# Altium schematic sheet G11-KeyDispPrint.SCHDOC
size A3; SheetNumber: 0; SheetTotal: 0
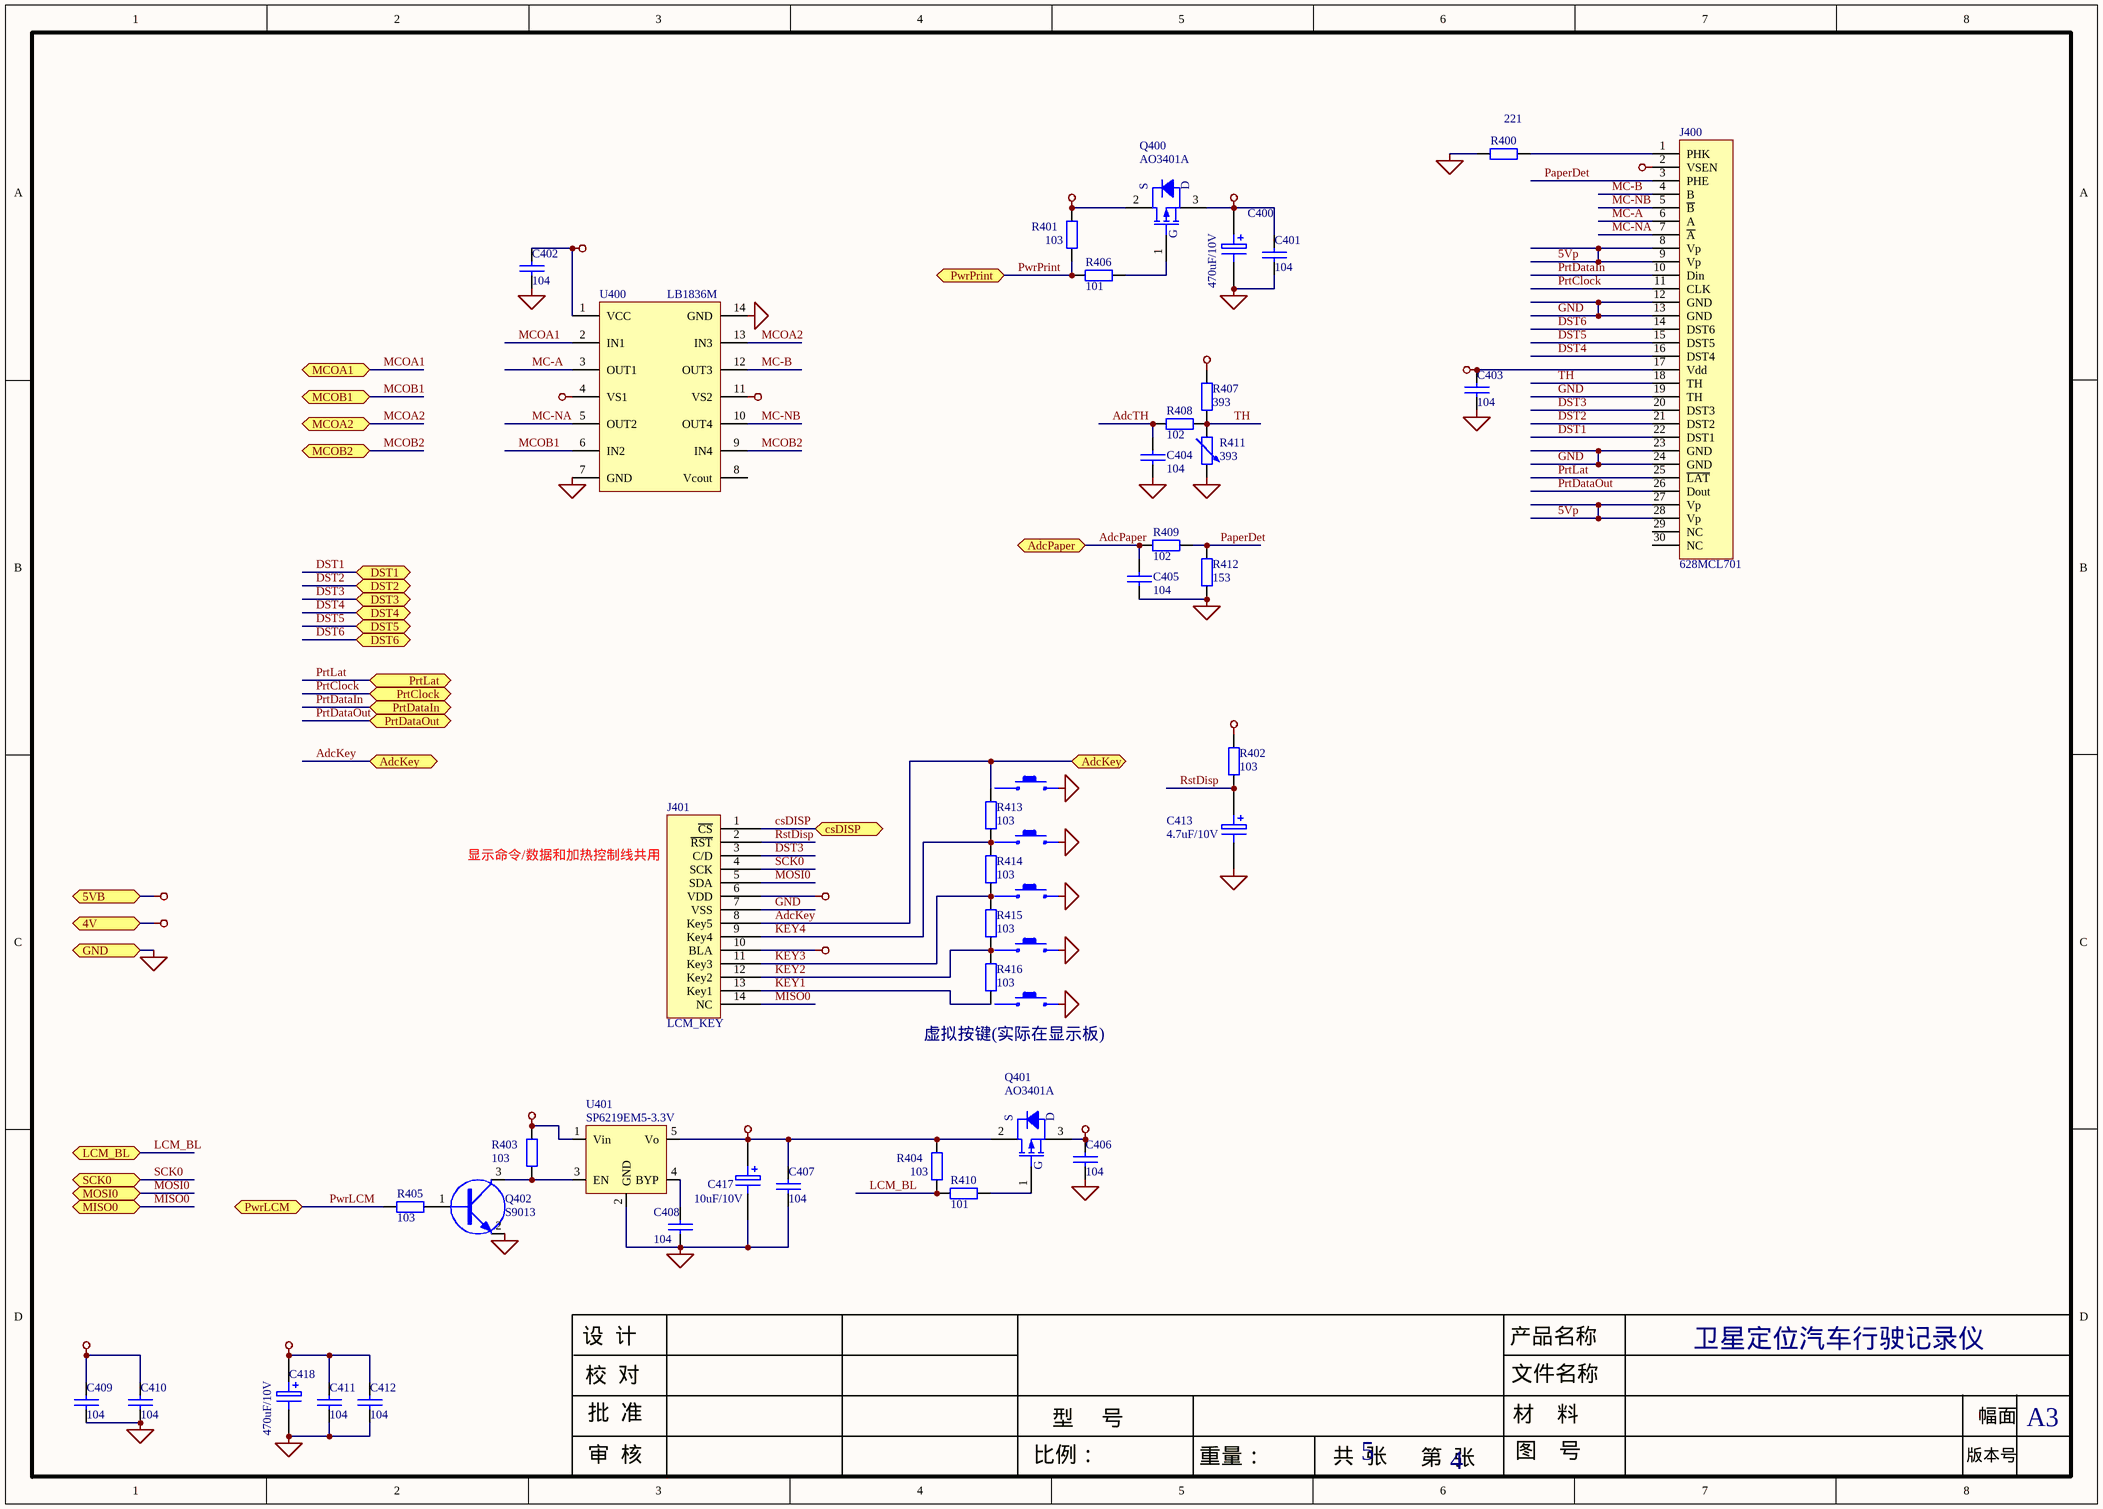
[diagram p0: G11-KeyDispPrint.SCHDOC]

## Parts
C400  470uF/10V  [RB-3.5mm]
C401  104  [C0603]
C402  104  [C0603]
C403  104  [C0603]
C404  104  [C0603]
C405  104  [C0603]
C406  104  [C0603]
C407  104  [C0603]
C408  104  [C0603]
C409  104  [C0603]
C410  104  [C0603]
C411  104  [C0603]
C412  104  [C0603]
C413  4.7uF/10V  [A(3216)]
C417  10uF/10V  [A(3216)]
C418  470uF/10V  [RB-3.5mm]
J400  628MCL701  [FPC-30H]
J401  LCM_KEY  [FPC-14-1.0]
Q400  AO3401A  [SOT-233PM]
Q401  AO3401A  [SOT-233PM]
Q402  S9013  [SOT-233]
R400  221  [R0603]
R401  103  [R0603]
R402  103  [R0603]
R403  103  [R0603]
R404  103  [R0603]
R405  103  [R0603]
R406  101  [R0603]
R407  393  [R0603]
R408  102  [R0603]
R409  102  [R0603]
R410  101  [R0603]
R411  value 393  [0603]  (hidden comment: Res Adj2)
R412  153  [R0603]
R413  103  [R0603]
R414  103  [R0603]
R415  103  [R0603]
R416  103  [R0603]
U400  LB1836M  [SO-G14-1.0mm]
U401  SP6219EM5-3.3V  [SOT-235]

## Ports
4V (bidir), 5VB (bidir), AdcKey, AdcKey (bidir), AdcPaper (bidir), csDISP (bidir), DST1 (bidir), DST2 (bidir), DST3 (bidir), DST4 (bidir), DST5 (bidir), DST6 (bidir), GND (bidir), LCM_BL (bidir), MCOA1 (bidir), MCOA2 (bidir), MCOB1 (bidir), MCOB2 (bidir), MISO0 (bidir), MOSI0 (bidir), PrtClock, PrtDataIn, PrtDataOut, PrtLat, PwrLCM (bidir), PwrPrint (bidir), SCK0 (bidir)

## Nets
3V3Lcm: C407.2 C417.1 J401.6(VDD) Q401.2(D) R402.1 R404.1 U401.5(Vo)
3V_BL: C406.2 J401.10(BLA) Q401.3(S)
4V: R403.2 U401.1(Vin) ; port 4V
5VB: C402.2 C409.2 C410.2 C411.2 C412.2 C418.1 Q400.2(D) R401.1 R407.1 U400.1(VCC) U400.4(VS1) U400.11(VS2) ; port 5VB
5Vp: C400.1 C401.2 C403.2 J400.2(VSEN) J400.8(Vp) J400.9(Vp) J400.17(Vdd) J400.27(Vp) J400.28(Vp) Q400.3(S)
GND: C400.2 C401.1 C402.1 C403.1 C404.2 C405.2 C406.1 C407.1 C408.1 C409.1 C410.1 C411.1 C412.1 C413.2 C417.2 C418.2 J400.12(GND) J400.13(GND) J400.19(TH) J400.23(GND) J400.24(GND) J401.7(VSS) Q402.2(E) R400.1 R411.2 R412.2 U400.7(GND) U400.14(GND) U401.2(GND) ; port GND
AdcKey: J401.8(Key5) R413.1 ; port AdcKey
AdcPaper: C405.1 R409.1 ; port AdcPaper
AdcTH: C404.1 R408.1
csDISP: J401.1(~{CS}) ; port csDISP
DST1: J400.22(DST1) ; port DST1
DST2: J400.21(DST2) ; port DST2
DST3: J400.20(DST3) J401.3(C/D) ; port DST3
DST4: J400.16(DST4) ; port DST4
DST5: J400.15(DST5) ; port DST5
DST6: J400.14(DST6) ; port DST6
KEY1: J401.13(Key1) R416.2
KEY2: J401.12(Key2) R415.2 R416.1
KEY3: J401.11(Key3) R414.2 R415.1
KEY4: J401.9(Key4) R413.2 R414.1
LCM_BL: R404.2 R410.2 ; port LCM_BL
MC-A: J400.6(A) U400.3(OUT1)
MC-B: J400.4(B) U400.12(OUT3)
MC-NA: J400.7(~{A}) U400.5(OUT2)
MC-NB: J400.5(~{B}) U400.10(OUT4)
MCOA1: U400.2(IN1) ; port MCOA1
MCOA2: U400.13(IN3) ; port MCOA2
MCOB1: U400.6(IN2) ; port MCOB1
MCOB2: U400.9(IN4) ; port MCOB2
MISO0: J401.14(NC) ; port MISO0
MOSI0: J401.5(SDA) ; port MOSI0
PaperDet: J400.3(PHE) R409.2 R412.1
PrtClock: J400.11(CLK) ; port PrtClock
PrtDataIn: J400.10(Din) ; port PrtDataIn
PrtDataOut: J400.26(Dout) ; port PrtDataOut
PrtLat: J400.25(~{LAT}) ; port PrtLat
PwrLCM: R405.2 ; port PwrLCM
PwrPrint: R401.2 R406.2 ; port PwrPrint
RstDisp: C413.1 J401.2(~{RST}) R402.2
SCK0: J401.4(SCK) ; port SCK0
TH: J400.18(TH) R407.2 R408.2 R411.1
NetC408_2: C408.2 U401.4(BYP)
NetJ400_1: J400.1(PHK) R400.2
NetQ400_1: Q400.1(G) R406.1
NetQ401_1: Q401.1(G) R410.1
NetQ402_1: Q402.1(B) R405.1
NetQ402_3: Q402.3(C) R403.1 U401.3(EN)

Not connected (* = marked no-connect by the designer): J400 29(NC) 30(NC); U400 8(Vcout)

## Notes on the sheet
- 显示命令/数据和加热控制线共用
- (near R416) 虚拟按键(实际在显示板)
- 设  计
- 校  对
- 产品名称
- 文件名称
- 卫星定位汽车行驶记录仪
- 审  核
- 批  准
- 比例：
- 型     号
- 5
- 材    料
- 图    号
- 版本号
- 幅面
- A3
- 重量：
- 共  张
- 第  张
- 4
- Labels drawn without touching a wire or pin: GND

## Library data of the parts
C400 C418 = ELECTRO1: 直插电解; C: Cap
C401-C403 C406-C412 = CAP: Capacitor; Cap: Cap
C404 C405 = CAP: Capacitor; Cap: 贴片电容
C413 = ELECTRO1: 贴片钽电容
C417 = ELECTRO1: 贴片钽电容; C: 电解电容
J400 = 628MCL701: 贴片竖焊打印机接口
Q400 Q401 = MOSFET-P: 贴片P沟MOS管
Q402 = 9013
R400-R410 R412-R416 = Res2: 贴片电阻; Manufacturer: Generic Components; Class: Passive; SubClass: Resistor; Value: 15K; Published: 08/06/2000; Publisher: Altium Hobart Technology Centre
R411 = Res Adj2: 贴片热敏电阻; Set Position: 0.5; Published: 8-Jun-2000; Revision: July-2002: Re-released for DXP Platform.; Publisher: Altium Limited
U400 = LB1836M: 贴片IC
U401 = SPX5205: 贴片电源LDO